# EAGLE schematic main (EAGLE 9.6.2)
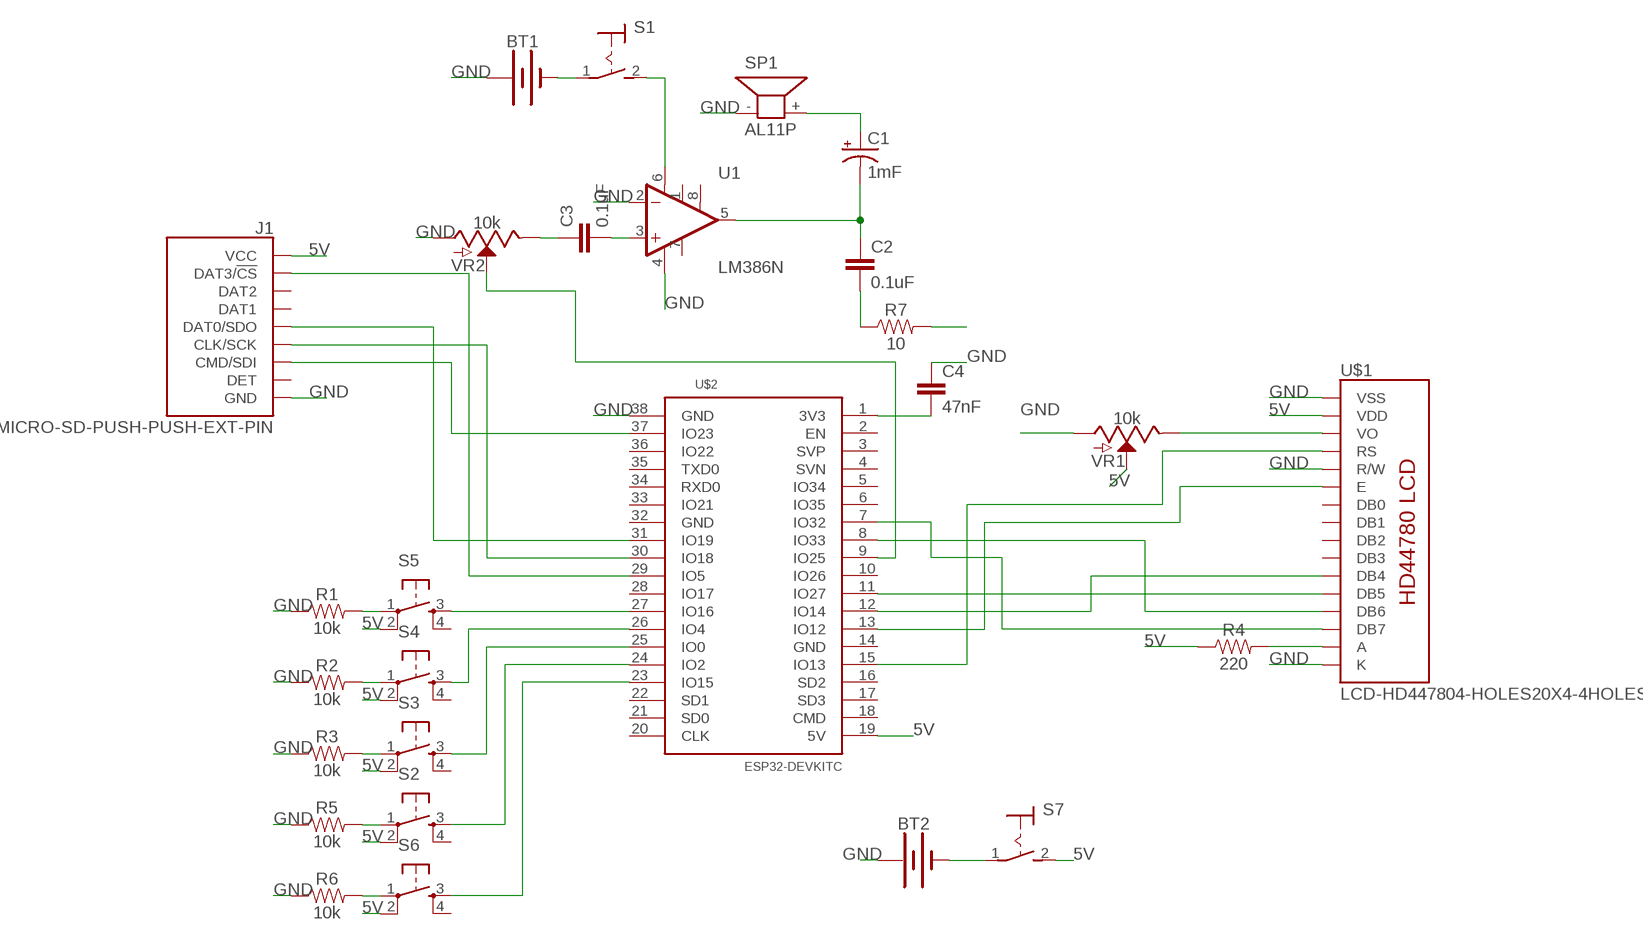
[diagram p0: schematic, sheet 1]

## Parts
BT1  BATTERY-9V  [BATTCON_9V]
BT2  BATTERY-9V  [BATTCON_9V]
C1  1mF  1000UF-RADIAL-5MM-25V-20%  [CPOL-RADIAL-5MM-10MM]
C2  0.1uF  0.1UF-KIT-EZ-50V-20%  [CAP-PTH-SMALL-KIT]
C3  0.1uF  0.1UF-KIT-EZ-50V-20%  [CAP-PTH-SMALL-KIT]
C4  47nF  47NF-0603-25V-5%  [0603]
J1  MICRO-SD-PUSH-PUSH-EXT-PIN  [MICROSD-EXTERNALPIN]
R1  10k  10KOHM-HORIZ-1/4W-1%  [AXIAL-0.3]
R2  10k  10KOHM-HORIZ-1/4W-1%  [AXIAL-0.3]
R3  10k  10KOHM-HORIZ-1/4W-1%  [AXIAL-0.3]
R4  220  220OHM-0603-1/10W-1%  [0603]
R5  10k  10KOHM-HORIZ-1/4W-1%  [AXIAL-0.3]
R6  10k  10KOHM-HORIZ-1/4W-1%  [AXIAL-0.3]
R7  10  10OHM-HORIZ-1/4W-1%  [AXIAL-0.3]
S1  MS243  [MS243]
S2  TAC_SWITCHPTH  [TACTILE-PTH]
S3  TAC_SWITCHPTH  [TACTILE-PTH]
S4  TAC_SWITCHPTH  [TACTILE-PTH]
S5  TAC_SWITCHPTH  [TACTILE-PTH]
S6  TAC_SWITCHPTH  [TACTILE-PTH]
S7  MS243  [MS243]
SP1  AL11P  [AL11P]
U1  LM386N  LM386  [DIP08]
U$1  LCD-HD447804-HOLES20X4-4HOLES  [LCD-20X4-4HOLES]
U$2  ESP32DEVKITC  [ESP32-DEVKITC]
VR1  10k  POTENTIOMETER_SLIDE-60MM-1/2W-20%  [SLIDER-XLARGE]
VR2  10k  POTENTIOMETER_SLIDE-60MM-1/2W-20%  [SLIDER-XLARGE]

## Nets
5V: J1.4(VCC) R4.1 S2.2 S3.2 S4.2 S5.2 S6.2 S7.2(S) U$1.P$2(VDD) U$2.19(5V) VR1.2A(S)
GND: BT1.+ BT2.+ C4.1 J1.6(GND) J1.10(GND) J1.11(GND) J1.12(GND) J1.13(GND) R1.P$1 R2.P$1 R3.P$1 R5.P$1 R6.P$1 SP1.- U1.2(-IN) U1.4(V-) U$1.P$1(VSS) U$1.P$5(R/W) U$1.P$16(K) U$2.38(GND) VR1.3(A) VR2.3(A)
N$1: U$1.P$3(VO) VR1.1(E)
N$2: U$1.P$4(RS) U$2.15(IO13)
N$3: U$1.P$6(E) U$2.13(IO12)
N$4: R4.2 U$1.P$15(A)
N$5: S2.3 U$2.24(IO2)
N$6: U$1.P$13(DB6) U$2.8(IO33)
N$7: U$1.P$11(DB4) U$2.12(IO14)
N$8: U$1.P$12(DB5) U$2.11(IO27)
N$9: S6.3 U$2.23(IO15)
N$10: R6.P$2 S6.1
N$11: C1.+ SP1.+
N$12: R5.P$2 S2.1
N$13: C1.- C2.1 U1.5(OUT)
N$14: R3.P$2 S3.1
N$15: U$1.P$14(DB7) U$2.7(IO32)
N$16: S3.3 U$2.25(IO0)
N$17: S4.3 U$2.26(IO4)
N$18: S5.3 U$2.27(IO16)
N$19: C2.2 R7.P$1
N$20: R7.P$2
N$21: U$2.9(IO25) VR2.2A(S)
N$22: BT1.- S1.1(P)
N$23: C3.1 VR2.1(E)
N$24: R2.P$2 S4.1
N$25: J1.2(DAT3/!CS!) U$2.29(IO5)
N$26: R1.P$2 S5.1
N$27: J1.5(CLK/SCK) U$2.30(IO18)
N$28: J1.3(CMD/SDI) U$2.37(IO23)
N$29: J1.7(DAT0/SDO) U$2.31(IO19)
N$30: C3.2 U1.3(+IN)
N$31: S1.2(S) U1.6(V+)
N$32: C4.2 U$2.1(3V3)
N$33: BT2.- S7.1(P)
Unconnected: J1.1(DAT2) J1.8(DAT1) J1.9(DET) S2.4 S3.4 S4.4 S5.4 S6.4 U1.1(GAIN) U1.7(BP) U1.8(GAIN) U$1.P$7(DB0) U$1.P$8(DB1) U$1.P$9(DB2) U$1.P$10(DB3) U$2.2(EN) U$2.3(SVP) U$2.4(SVN) U$2.5(IO34) U$2.6(IO35) U$2.10(IO26) U$2.14(GND) U$2.16(SD2) U$2.17(SD3) U$2.18(CMD) U$2.20(CLK) U$2.21(SD0) U$2.22(SD1) U$2.28(IO17) U$2.32(GND) U$2.33(IO21) U$2.34(RXD0) U$2.35(TXD0) U$2.36(IO22)

## Library data of the parts
BT1 BT2 = SparkFun-Batteries:BATTERY: Battery - Single Cell A variety of battery chemistries, sizes, and footprints. Device List: 20MM_PTH - Coin Cell Battery Holder - 20mm (PTH) <https://www.sparkfun.com/products/783> 20MM_PTH_KIT- Coin Cell battery Holder - 20 mm (PTH) <http://www.sparkfun.com/products/783>kit version with special mask 6.8MM_PTH - Coin Cell Battery Holder - 6.8MM(SMD) <https://www.digikey.com/product-detail/en/seiko-instruments/MS621FE-FL11E/728-1057-ND/1889208?WT.srch=1&gclid=CNOQ5a6LzdQCFZS2wAodXCkE0g> 12MM_SMD - Coin Cell Battery Holder - 12mm (SMD) <https://www.sparkfun.com/products/10592> 12MM_PTH - Coin Cell Battery Holder - 12mm (PTH) <https://www.sparkfun.com/products/7948> 20MM_SMD - 20mm Coin Cell Battery Holder (SMD) (2 legs) Used on the Big Time Watch Kit <https://www.sparkfun.com/products/11734> 20MM_SMD_4LEGS - Coin Cell Battery Holder - 20mm (SMD) <https://www.sparkfun.com/products/11892> 20MM_SMD_4LEGS_OVERPASTE - Coin Cell Battery Holder - 20mm (SMD) <https://www.sparkfun.com/products/11892> (Over-paste on the legs) 24.5MM_PTH - Coin Cell Battery Holder - 24.5mm (PTH) <https://www.sparkfun.com/products/8863> 9V - 9V Battery Holder - PC Mount Used on the SparkFun SparkPunk Sound Kit <https://www.sparkfun.com/products/11177> and SparkFun SparkPunk Sequencer Kit <https://www.sparkfun.com/products/12707> 18650 - Battery Holder - 18650 (PTH) <https://www.sparkfun.com/products/13113> AA - Battery Holder - 1xAA (PTH) <https://www.sparkfun.com/products/7949> AAA - Battery Holder - 1xAAA (PTH) <https://www.sparkfun.com/products/12718> AA_KIT - Battery Holder - 1xAA (PTH) <https://www.sparkfun.com/products/7949> Special kit package - pads only have exposed copper on one side of the board. AAA_KIT - Battery Holder - 1xAAA (PTH) <https://www.sparkfun.com/products/12718> Special kit package - pads only have exposed copper on one side of the board.; PROD_ID: BATT-10855
C1 = SparkFun-Capacitors:1000UF: 1,000µF/1mF ceramic capacitors A capacitor is a passive two-terminal electrical component used to store electrical energy temporarily in an electric field. CAP-08070; PROD_ID: CAP-09538
C2 C3 = SparkFun-Capacitors:0.1UF: 0.1µF ceramic capacitors A capacitor is a passive two-terminal electrical component used to store electrical energy temporarily in an electric field.; PROD_ID: CAP-08370
C4 = SparkFun-Capacitors:47NF: 47nF ceramic capacitors A capacitor is a passive two-terminal electrical component used to store electrical energy temporarily in an electric field.; PROD_ID: CAP-08605
J1 = SparkFun-Connectors:MICRO-SD: microSD Socket for Transflash Various sockets for µSD. tDoc lines correctly indicate media card edge positions when inserting (unlocked, locked, depressed). NOTE: CD1 and CD2 are connected internally, and the default detect state of the socket is detect pin to ground. SparkFun Products: WAV Trigger <https://www.sparkfun.com/products/13660> CAN-Bus Shield <https://www.sparkfun.com/products/13262> SparkFun Level Shifing microSD Breakout <https://www.sparkfun.com/products/13743>; PROD_ID: CONN-16110
R1-R3 R5 R6 = SparkFun-Resistors:10KOHM: 10kΩ resistor A resistor is a passive two-terminal electrical component that implements electrical resistance as a circuit element. Resistors act to reduce current flow, and, at the same time, act to lower voltage levels within circuits. - Wikipedia; PROD_ID: RES-12183
R4 = SparkFun-Resistors:220OHM: 220Ω resistor A resistor is a passive two-terminal electrical component that implements electrical resistance as a circuit element. Resistors act to reduce current flow, and, at the same time, act to lower voltage levels within circuits. - Wikipedia; PROD_ID: RES-07861
R7 = SparkFun-Resistors:10OHM: 10Ω resistor A resistor is a passive two-terminal electrical component that implements electrical resistance as a circuit element. Resistors act to reduce current flow, and, at the same time, act to lower voltage levels within circuits. - Wikipedia; PROD_ID: RES-12180
S1 S7 = switch:MS243: TOGGLE SWITCH
S2-S6 = SparkFun-Retired:TAC_SWITCH: Momentary Switch Button commonly used for reset or general input. Spark Fun Electronics SKU : COM-00097 SMT- SWCH-08247; SPICEPREFIX: S
SP1 = buzzer:AL11P: SPEAKER Source: Buerklin; OC_FARNELL: unknown; OC_NEWARK: unknown
U1 = SparkFun-IC-Amplifiers:LM386: low voltage audio power amplifier SparkFun Products FabFM Radio Kit <https://www.sparkfun.com/products/11043> (KIT-11043); PROD_ID: IC-10899
U$1 = HD44780LCD:LCD-HD44780
U$2 = ESP32-DEVKITC:ESP32DEVKITC
VR1 VR2 = SparkFun-Resistors:POTENTIOMETER_SLIDE: Slide Potentiometer Slide-type potentiometers - pots that are adjusted by sliding a wiper up or down. Commonly found en-masse on sound boards. Variants 60MM - Slide Pot - X-Large (10k Linear Taper) <https://www.sparkfun.com/products/9119> (COM-09119) 10k linear slide pot with 60mm travel. Datasheet <http://cdn.sparkfun.com/datasheets/Components/Switches/SC608N-b10k.pdf> 30MM, 30MM-KIT - Slide Pot - Medium (10k Linear Taper) <https://www.sparkfun.com/products/11621> (COM-11621) 10k linear slide pot with 30mm travel. Datasheet <http://cdn.sparkfun.com/datasheets/Components/Switches/C-31-.pdf> (C3031N-1A2-B10K-GP) "KIT" variant, intended for soldering kits, has tStop removed from pads so the component can only be stuffed on one side of the board. 20MM - Slide Pot - Small (10k Linear Taper) <https://www.sparkfun.com/products/11620> (COM-11620) 10k linear slide pot with 20mm travel. Datasheet <http://cdn.sparkfun.com/datasheets/Components/Switches/C-31-.pdf> (C2031N-1A2-B10K-GP); PROD_ID: RES-09484; SF_SKU: COM-09119